# Altium schematic sheet ServoMotCTRL.SchDoc: Servo Motor Connection
size B; Date: 2015-01-23; Author: Marcin Czajkowski; Organization: Marcin Czajkowski; Address1: SN: 3547684; Address2: ESE-Year2; Address3: Conestoga College; Address4: Project IV; DocumentNumber: 8; Revision: A; SheetNumber: 7; SheetTotal: 14
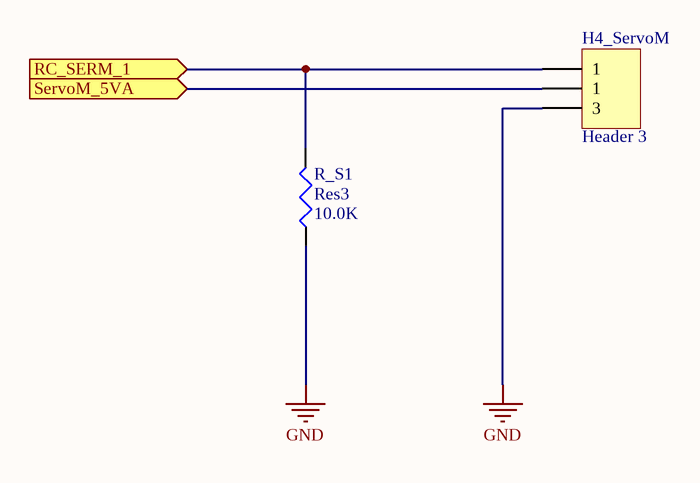
[diagram p0: ServoMotCTRL.SchDoc]

## Parts
H4_ServoM  Header 3  [HDR1X3]
R_S1  Res3  value 10.0K  [RESC2112X05M]

## Ports
RC_SERM_1 (in), ServoM_5VA (in)

## Nets
GND: H4_ServoM.3 R_S1.1
RC_SERM_1: H4_ServoM.1 R_S1.2 ; port RC_SERM_1
ServoM_5VA: H4_ServoM.1 ; port ServoM_5VA

## Notes on the sheet
- ESE
- is the sole property of ESE. Any reproduction
- The Information Contained in this drawing
- Schematic P/N and Name
- Sheet Name
- 299 Doon Valley Drive
- Kitchener, ON N2G 4M4
- Canada
- Approved
- in part or in whole without the written
- permission of ESE is strictly prohibited.
- APPROVALS
- DATE
- Size
- Scale
- B
- NTS
- Bare PCB P/N
- Date
- Sheet
- Rev.
- Checked
- Engineer
- of

## Library data of the parts
H4_ServoM = Header 3: Header, 3-Pin; LatestRevisionDate: 17-Jul-2002; LatestRevisionNote: Re-released for DXP Platform.; Publisher: Altium Limited
R_S1 = Resistor_10.0K: RES SMD 10.0K OHM 1% 1/8W 0805; MPN: CRCW080510K0FKEA; PN: 541-10.0KCCT-ND; Name: Resistor_10.0K; URL: http://www.digikey.ca/product-detail/en/CRCW080510K0FKEA/541-10.0KCCT-ND